# EAGLE design obd25k80 (EAGLE 9.6.2)
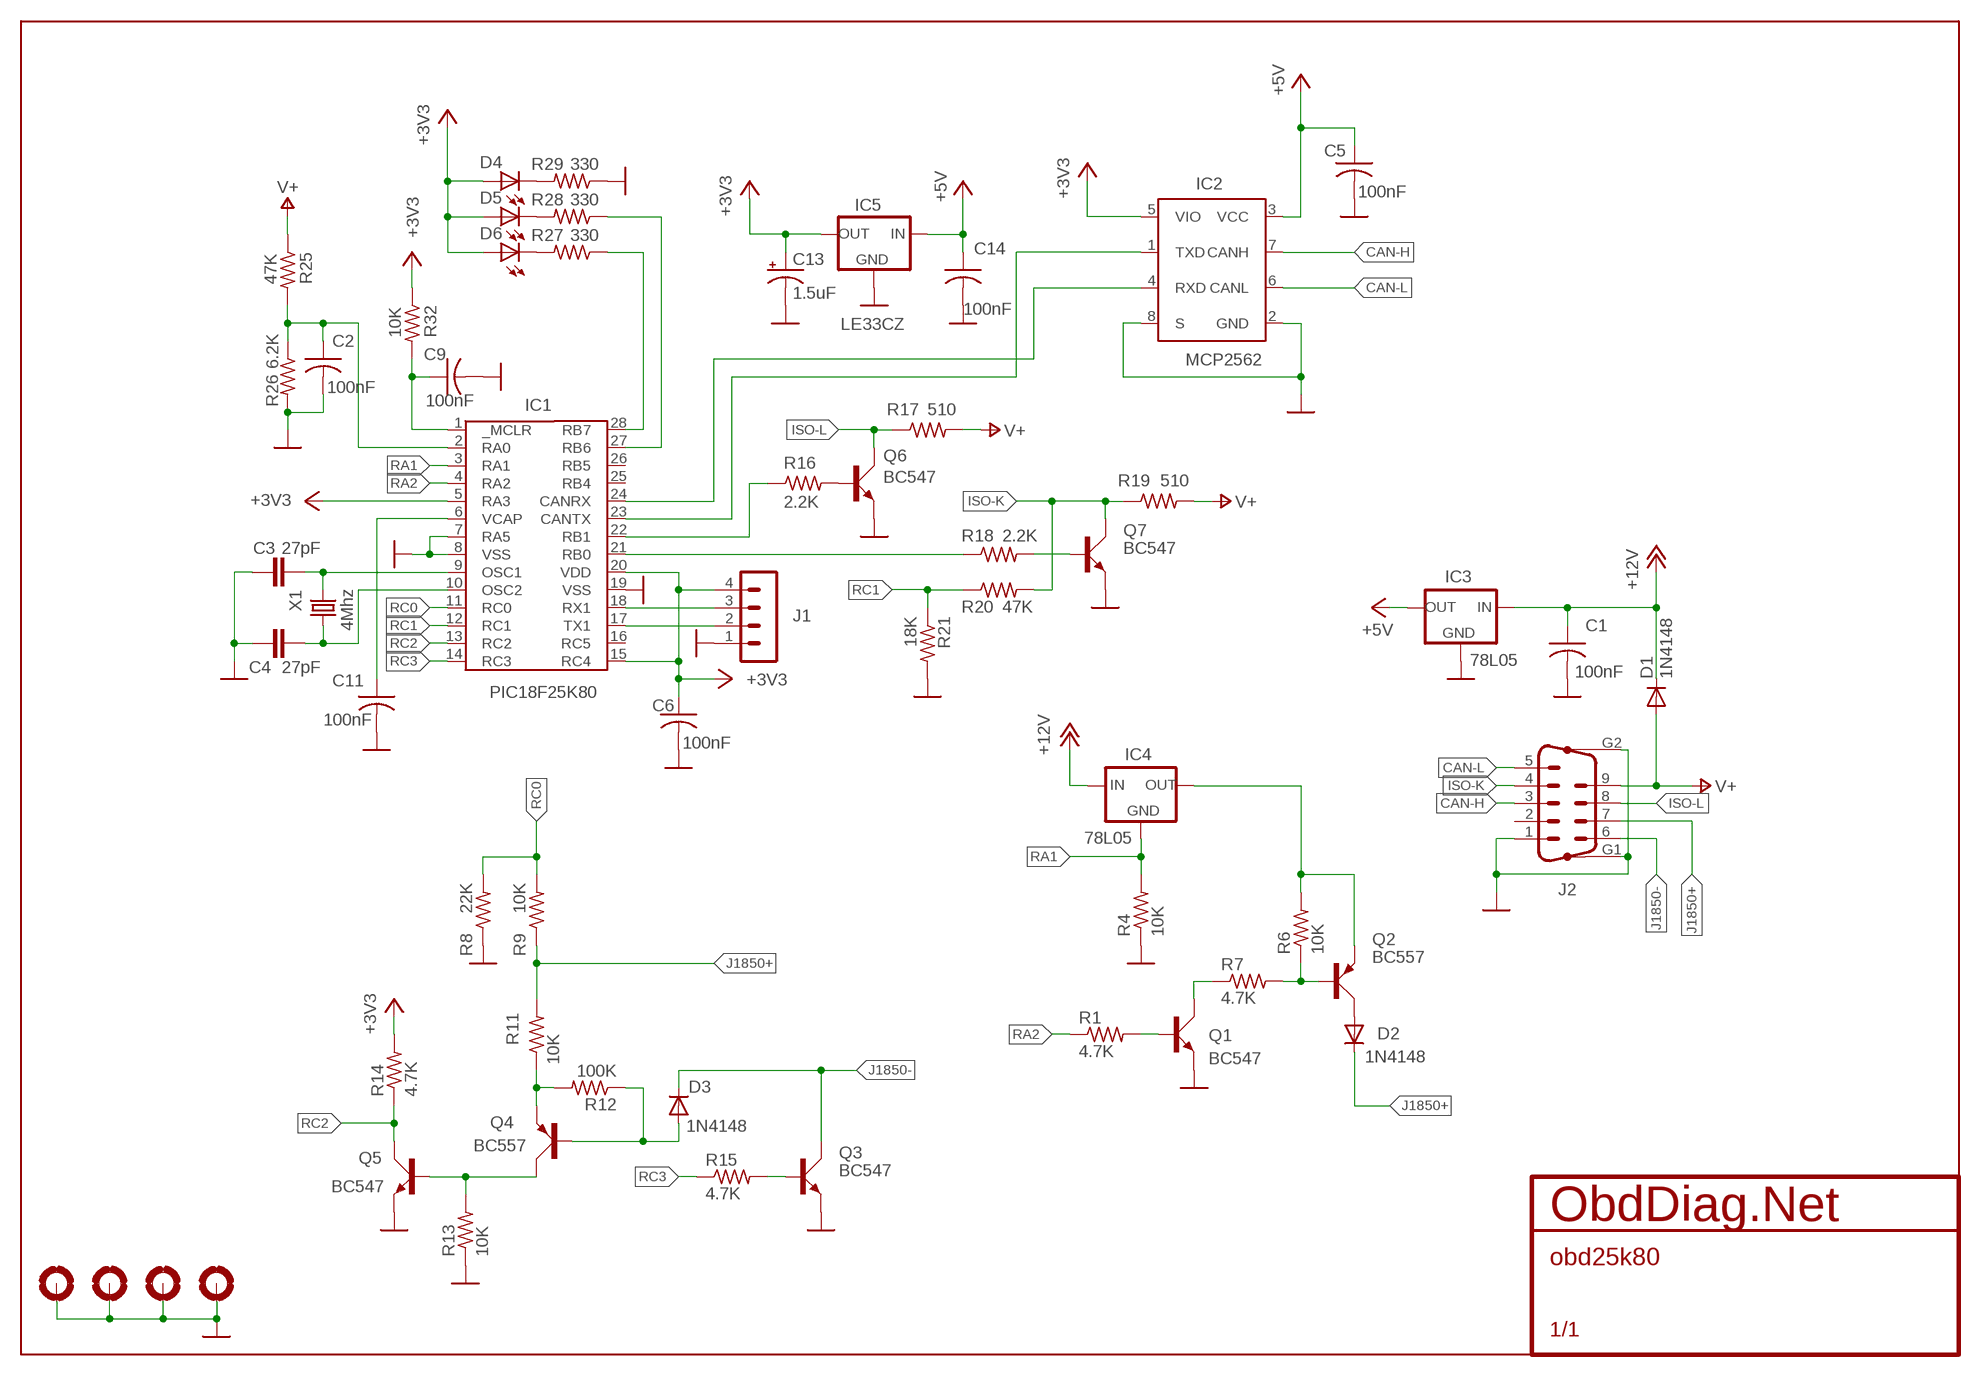
[diagram p0: schematic, sheet 1]

## Parts
C1  100nF  C-US050-025X075  [C050-025X075]
C2  100nF  C-US050-025X075  [C050-025X075]
C3  27pF  C2.5/2  [C2.5-2]
C4  27pF  C2.5/2  [C2.5-2]
C5  100nF  C-US050-025X075  [C050-025X075]
C6  100nF  C-US050-025X075  [C050-025X075]
C9  100nF  C-US050-025X075  [C050-025X075]
C11  100nF  C-US050-025X075  [C050-025X075]
C13  1.5uF  CPOL-USE2.5-5  [E2,5-5]
C14  100nF  C-US050-025X075  [C050-025X075]
D1  1N4148  1N4148M  [D035-10M]
D2  1N4148  1N4148M  [D035-10M]
D3  1N4148  1N4148M  [D035-10M]
D4  LED5MM  [LED5MM]
D5  LED5MM  [LED5MM]
D6  LED5MM  [LED5MM]
H1  MOUNT-PAD-ROUND2.8  [2,8-PAD]
H2  MOUNT-PAD-ROUND2.8  [2,8-PAD]
H3  MOUNT-PAD-ROUND2.8  [2,8-PAD]
H4  MOUNT-PAD-ROUND2.8  [2,8-PAD]
IC1  PIC18F25K80  [DIL28]
IC2  MCP2562  [DIL8]
IC3  78L05  78LXX  [78LXX]
IC4  78L05  78LXX  [78LXX]
IC5  LE33CZ  78LXX  [78LXX]
J1  MA04-1  [MA04-1]
J2  DB9-M  M09HP  [M09HP]
Q1  BC547  [SOT54A]
Q2  BC557  [SOT54A]
Q3  BC547  [SOT54A]
Q4  BC557  [SOT54A]
Q5  BC547  [SOT54A]
Q6  BC547  [SOT54A]
Q7  BC547  [SOT54A]
R1  4.7K  R-US_0207/10  [0207/10]
R4  10K  R-US_0207/10  [0207/10]
R6  10K  R-US_0207/10  [0207/10]
R7  4.7K  R-US_0207/10  [0207/10]
R8  22K  R-US_0207/10  [0207/10]
R9  10K  R-US_0207/10  [0207/10]
R11  10K  R-US_0207/10  [0207/10]
R12  100K  R-US_0207/10  [0207/10]
R13  10K  R-US_0207/10  [0207/10]
R14  4.7K  R-US_0207/10  [0207/10]
R15  4.7K  R-US_0207/10  [0207/10]
R16  2.2K  R-US_0207/10  [0207/10]
R17  510  R-US_0207/10  [0207/10]
R18  2.2K  R-US_0207/10  [0207/10]
R19  510  R-US_0207/10  [0207/10]
R20  47K  R-US_0207/10  [0207/10]
R21  18K  R-US_0207/10  [0207/10]
R25  47K  R-US_0207/10  [0207/10]
R26  6.2K  R-US_0207/10  [0207/10]
R27  330  R-US_0207/10  [0207/10]
R28  330  R-US_0207/10  [0207/10]
R29  330  R-US_0207/10  [0207/10]
R32  10K  R-US_0207/10  [0207/10]
X1  4Mhz  CRYTALHC49S  [HC49/S]

## Nets
+3V3: C6.1 C13.+ D4.A D5.A D6.A IC1.5(RA3) IC1.15(RC4) IC1.20(VDD) IC2.5(VIO) IC5.OUT J1.4 R14.2 R32.1
+5V: C5.1 C14.1 IC2.3(VCC) IC3.OUT IC5.IN
+12V: C1.1 D1.C IC3.IN IC4.IN
CAN-H: IC2.7(CANH) J2.3
CAN-L: IC2.6(CANL) J2.5
GND: C1.2 C2.2 C3.1 C4.2 C5.2 C6.2 C9.2 C11.2 C13.- C14.2 H1.B2,8(MOUNT) H2.B2,8(MOUNT) H3.B2,8(MOUNT) H4.B2,8(MOUNT) IC1.7(RA5) IC1.8(VSS) IC1.19(VSS) IC2.2(GND) IC2.8(S) IC3.GND IC5.GND J1.1 J2.1 J2.G1 J2.G2 Q1.E Q3.E Q5.E Q6.E Q7.E R4.1 R8.1 R13.1 R21.2 R26.2 R29.1
ISO-K: J2.4 Q7.C R19.1 R20.2
ISO-L: J2.8 Q6.C R17.1
J1850+: D2.C J2.7 R9.1 R11.2
J1850-: D3.C J2.6 Q3.C
N$1: D4.K(C) R29.2
N$2: IC1.28(RB7) R27.1
N$6: D5.K(C) R28.2
N$7: C9.1 IC1.1(_MCLR) R32.2
N$9: IC1.22(RB1) R16.1
N$10: D6.K(C) R27.2
N$11: IC1.27(RB6) R28.1
N$14: C11.1 IC1.6(VCAP)
N$15: Q6.B R16.2
N$16: IC1.18(RX1) J1.3
N$17: IC1.24(CANRX) IC2.4(RXD)
N$18: IC1.17(TX1) J1.2
N$20: IC1.21(RB0) R18.1
N$21: C3.2 IC1.9(OSC1) X1.2
N$22: Q3.B R15.2
N$23: IC1.23(CANTX) IC2.1(TXD)
N$24: Q7.B R18.2
N$25: Q1.C R7.1
N$26: C2.1 IC1.2(RA0) R25.2 R26.1
N$28: Q1.B R1.2
N$30: Q2.B R6.1 R7.2
N$31: IC4.OUT Q2.E R6.2
N$32: D2.A Q2.C
N$37: Q4.E R11.1 R12.2
N$38: D3.A Q4.B R12.1
N$39: Q4.C Q5.B R13.2
N$41: C4.1 IC1.10(OSC2) X1.1
RA1: IC1.3(RA1) IC4.GND R4.2
RA2: IC1.4(RA2) R1.1
RC0: IC1.11(RC0) R8.2 R9.2
RC1: IC1.12(RC1) R20.1 R21.1
RC2: IC1.13(RC2) Q5.C R14.1
RC3: IC1.14(RC3) R15.1
V+: D1.A J2.9 R17.2 R19.2 R25.1
Unconnected: IC1.16(RC5) IC1.25(RB4) IC1.26(RB5) J2.2

## Library data of the parts
C1 C2 C5 C6 C9 C11 C14 = rcl:C-US: CAPACITOR, American symbol; SPICEPREFIX: C
C3 C4 = capacitor-wima:C: CAPACITOR naming: grid - package width
C13 = rcl:CPOL-US: POLARIZED CAPACITOR, American symbol
D1-D3 = diode:1N4148: DIODE high speed (Philips)
D4-D6 = led:LED: LED OSRAM: - CHIPLED LG R971, LG N971, LY N971, LG Q971, LY Q971, LO R971, LY R971 LH N974, LH R974 LS Q976, LO Q976, LY Q976 LO Q996 - Hyper CHIPLED LW Q18S LB Q993, LB Q99A, LB R99A - SideLED LS A670, LO A670, LY A670, LG A670, LP A670 LB A673, LV A673, LT A673, LW A673 LH A674 LY A675 LS A676, LA A676, LO A676, LY A676, LW A676 LS A679, LY A679, LG A679 - Hyper Micro SIDELED® LS Y876, LA Y876, LO Y876, LY Y876 LT Y87S - SmartLED LW L88C, LW L88S LB L89C, LB L89S, LG L890 LS L89K, LO L89K, LY L89K LS L896, LA L896, LO L896, LY L896 - TOPLED LS T670, LO T670, LY T670, LG T670, LP T670 LSG T670, LSP T670, LSY T670, LOP T670, LYG T670 LG T671, LOG T671, LSG T671 LB T673, LV T673, LT T673, LW T673 LH T674 LS T676, LA T676, LO T676, LY T676, LB T676, LH T676, LSB T676, LW T676 LB T67C, LV T67C, LT T67C, LS T67K, LO T67K, LY T67K, LW E67C LS E67B, LA E67B, LO E67B, LY E67B, LB E67C, LV E67C, LT E67C LW T67C LS T679, LY T679, LG T679 LS T770, LO T770, LY T770, LG T770, LP T770 LB T773, LV T773, LT T773, LW T773 LH T774 LS E675, LA E675, LY E675, LS T675 LS T776, LA T776, LO T776, LY T776, LB T776 LHGB T686 LT T68C, LB T68C - Hyper Mini TOPLED® LB M676 - Mini TOPLED Santana® LG M470 LS M47K, LO M47K, LY M47K Source: http://www.osram.convergy.de LUXEON: - LUMILED® LXK2-PW12-R00, LXK2-PW12-S00, LXK2-PW14-U00, LXK2-PW14-V00 LXK2-PM12-R00, LXK2-PM12-S00, LXK2-PM14-U00 LXK2-PE12-Q00, LXK2-PE12-R00, LXK2-PE12-S00, LXK2-PE14-T00, LXK2-PE14-U00 LXK2-PB12-K00, LXK2-PB12-L00, LXK2-PB12-M00, LXK2-PB14-N00, LXK2-PB14-P00, LXK2-PB14-Q00 LXK2-PR12-L00, LXK2-PR12-M00, LXK2-PR14-Q00, LXK2-PR14-R00 LXK2-PD12-Q00, LXK2-PD12-R00, LXK2-PD12-S00 LXK2-PH12-R00, LXK2-PH12-S00 LXK2-PL12-P00, LXK2-PL12-Q00, LXK2-PL12-R00 Source: www.luxeon.com KINGBRIGHT: KA-3528ASYC Source: www.kingbright.com
H1-H4 = holes:MOUNT-PAD-ROUND: MOUNTING PAD, round
IC1 = pic18f2455:PIC18F25K80
IC2 = obddiag-net:MCP2562
IC3-IC5 = v-reg:78LXX: VOLTAGE REGULATOR
J1 = obddiag-net:MA04-1
J2 = con-subd:M09HP: SUB-D
Q1 Q3 Q5-Q7 = transistor-small-signal:BC547: NPN TRANSISTOR
Q2 Q4 = transistor-small-signal:BC557: PNP TRANSISTOR
R1 R4 R6-R9 R11-R21 R25-R29 R32 = rcl:R-US_: RESISTOR, American symbol
X1 = crystal:CRYTAL: CRYSTAL

## Board
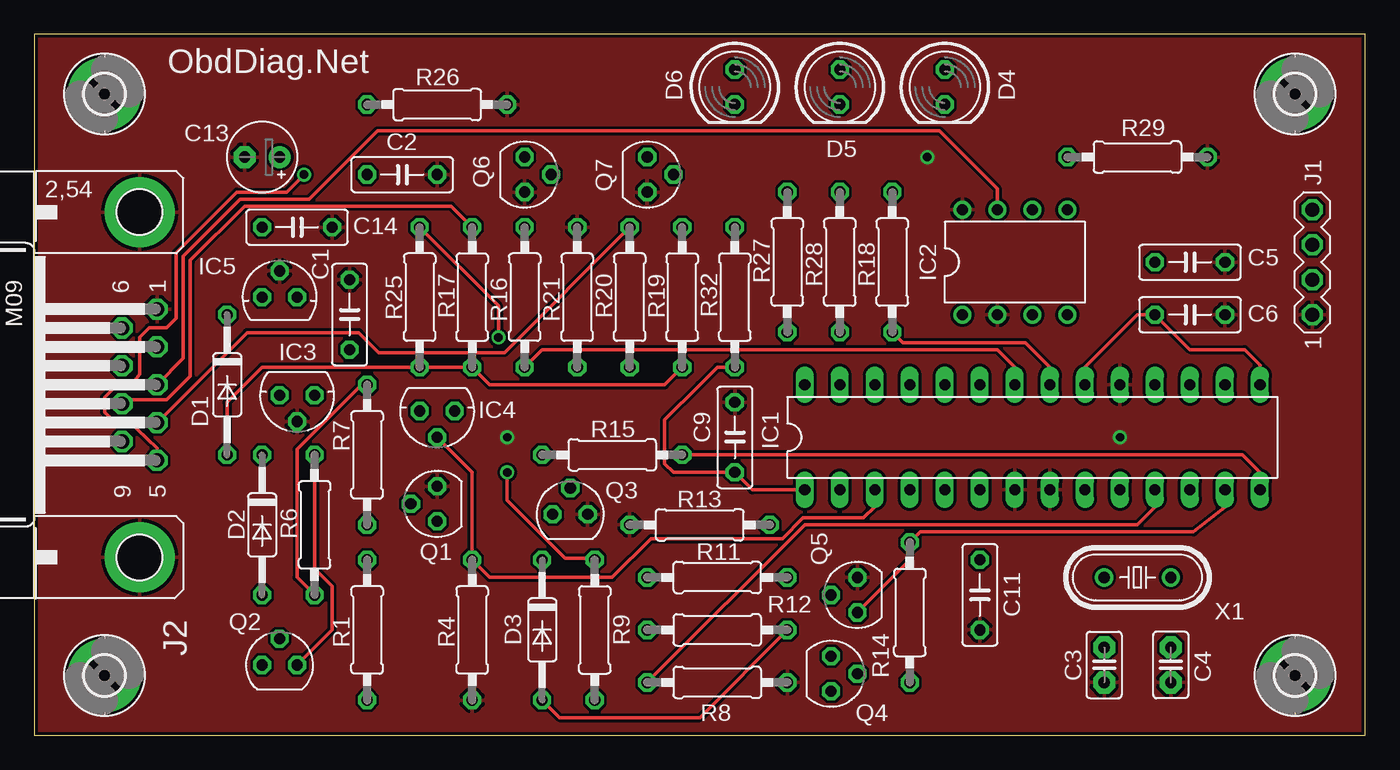
[diagram p1: board, top side]
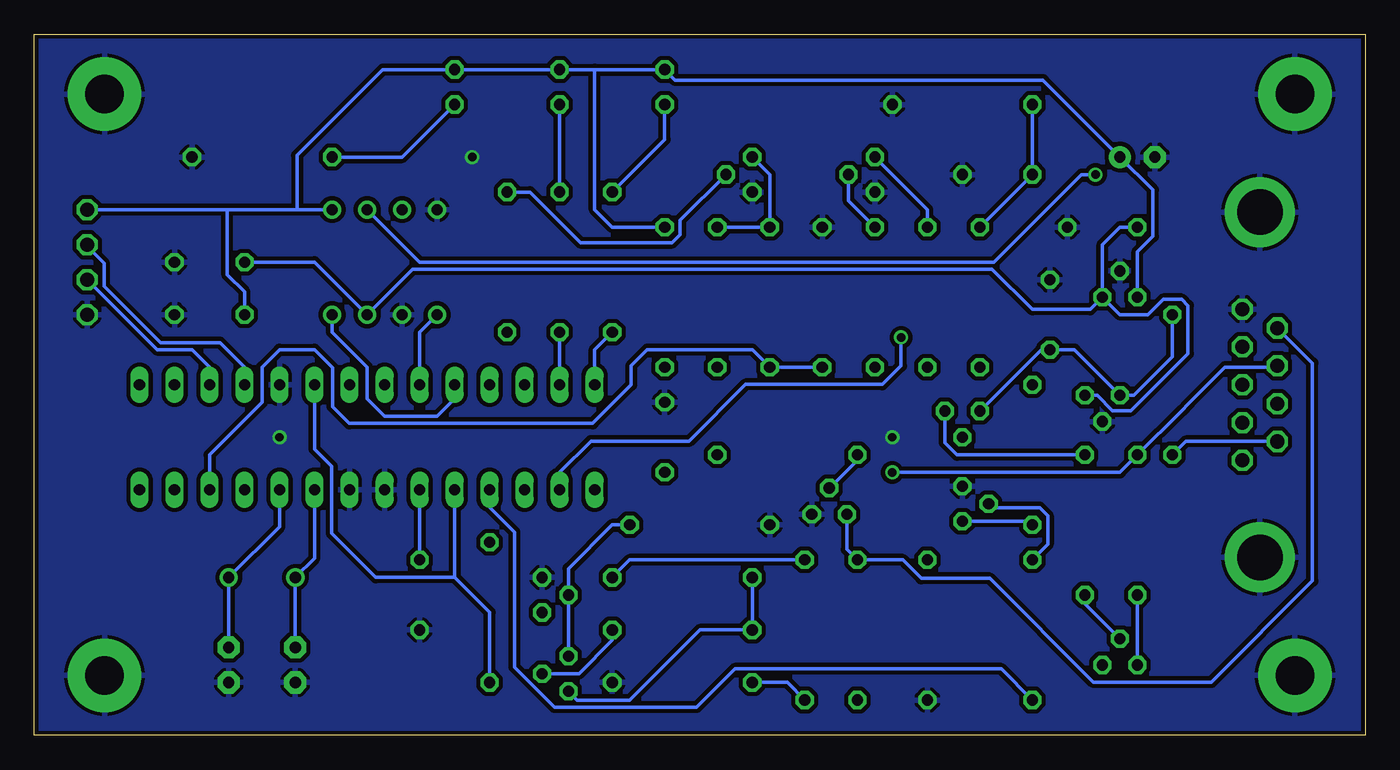
[diagram p2: board, bottom side, seen from below]

Size 96.52 x 50.8 mm. Coordinates in mm from the lower left corner, seen from the top.
Outline: 0,0 96.52,0 96.52,50.8 0,50.8 0,0
Copper layers (1*16): Top 0.035mm / dielectric 1.5mm / Bottom 0.035mm
Design rules "default *": minimum track width 10mil, minimum drill 24mil, track to track 8mil, track to pad 8mil, pad to pad 5mil, via to via 8mil, smd to smd 5mil, copper to edge 10mil, drill to drill 8mil, minimum pad ring 10mil, minimum via ring 8mil, stop-mask expansion 4mil, vias tented up to drill 0mil, thermal gap 10mil

### Footprints (pad centres in the part's own frame; a part is rotated, then mirrored left to right if it is on the bottom)
C050-025X075 = drill 0.813 octagon: 1 -2.54,0; 2 2.54,0
C2.5-2 = drill 0.813 pad 1.6 octagon: 1 -1.27,0; 2 1.27,0
E2,5-5 = drill 0.813 pad 1.6: + -1.27,0 | drill 0.813 pad 1.6 octagon: - 1.27,0
D035-10M = drill 0.813 octagon: A 5.08,0; C -5.08,0
LED5MM = drill 0.813 octagon: A -1.27,0; K 1.27,0
2,8-PAD = drill 2.8 pad 5.334: B2,8 0,0
DIL28 = drill 0.813 long: 1 -16.51,-3.81; 2 -13.97,-3.81; 3 -11.43,-3.81; 4 -8.89,-3.81; 5 -6.35,-3.81; 6 -3.81,-3.81; 7 -1.27,-3.81; 8 1.27,-3.81; 9 3.81,-3.81; 10 6.35,-3.81; 11 8.89,-3.81; 12 11.43,-3.81; 13 13.97,-3.81; 14 16.51,-3.81; 15 16.51,3.81; 16 13.97,3.81; 17 11.43,3.81; 18 8.89,3.81; 19 6.35,3.81; 20 3.81,3.81; 21 1.27,3.81; 22 -1.27,3.81; 23 -3.81,3.81; 24 -6.35,3.81; 25 -8.89,3.81; 26 -11.43,3.81; 27 -13.97,3.81; 28 -16.51,3.81
DIL8 = drill 0.813 pad 1.27: 1 -3.81,-3.81; 2 -1.27,-3.81; 3 1.27,-3.81; 4 3.81,-3.81; 5 3.81,3.81; 6 1.27,3.81; 7 -1.27,3.81; 8 -3.81,3.81
78LXX = drill 0.813 octagon: GND 0,1.905; IN 1.27,0; OUT -1.27,0
MA04-1 = drill 1.016 octagon: 1 -3.81,0; 2 -1.27,0; 3 1.27,0; 4 3.81,0
M09HP = drill 1.016 octagon: 1 -5.486,1.27; 2 -2.743,1.27; 3 0,1.27; 4 2.743,1.27; 5 5.486,1.27; 6 -4.115,-1.27; 7 -1.372,-1.27; 8 1.372,-1.27; 9 4.115,-1.27 | drill 3.302 pad 5.08: G1 -12.522,0; G2 12.522,0
SOT54A = drill 0.813 octagon: B 0,1.905; C -1.27,0; E 1.27,0
0207/10 = drill 0.813 octagon: 1 -5.08,0; 2 5.08,0
HC49/S = drill 0.813: 1 -2.413,0; 2 2.413,0

### Placement (x,y rotation side)
C1  22.86,30.48 90 top
C2  26.67,40.64 0 top
C3  77.6,5.08 90 top
C4  82.42,5.08 270 top
C5  83.82,34.29 0 top
C6  83.82,30.48 0 top
C9  50.8,21.59 90 top
C11  68.58,10.16 270 top
C13  2.2uF  [E2,5-5]  16.51,41.91 180 top
C14  19.05,36.83 0 top
D1  13.97,25.4 270 top
D2  16.51,15.24 270 top
D3  36.83,7.62 270 top
D4  66.04,46.99 270 top
D5  58.42,46.99 270 top
D6  50.8,46.99 270 top
H1  5.08,4.32 0 top
H2  5.08,46.48 0 top
H3  91.44,4.32 0 top
H4  91.44,46.48 0 top
IC1  72.39,21.59 0 top
IC2  71.12,34.29 0 top
IC3  19.05,24.64 180 top
IC4  29.21,23.5 180 top
IC5  17.78,31.75 0 top
J1  92.71,34.29 90 top
J2  7.62,25.4 270 top
Q1  29.21,16.76 90 top
Q2  17.78,5.08 0 top
Q3  38.86,16 0 top
Q4  57.78,4.45 270 top
Q5  59.69,10.16 90 top
Q6  35.56,40.64 270 top
Q7  44.45,40.64 270 top
R1  24.13,7.62 90 top
R4  31.75,7.62 90 top
R6  20.32,15.24 90 top
R7  24.13,20.32 90 top
R8  49.53,3.81 180 top
R9  40.64,7.62 270 top
R11  49.53,11.43 0 top
R12  49.53,7.62 180 top
R13  48.26,15.24 0 top
R14  63.5,8.89 270 top
R15  41.91,20.32 180 top
R16  35.56,31.75 90 top
R17  31.75,31.75 270 top
R18  62.23,34.29 90 top
R19  46.99,31.75 270 top
R20  43.18,31.75 90 top
R21  39.37,31.75 90 top
R25  27.94,31.75 90 top
R26  29.21,45.72 0 top
R27  54.61,34.29 90 top
R28  58.42,34.29 90 top
R29  80.01,41.91 180 top
R32  50.8,31.75 270 top
X1  80.01,11.43 180 top

### Tracks (layer width: path | path; a pad name or v marks a point on that pad's centre or on a via)
+3V3
  Top 0.254: IC1.15 88.9,26.8 88.93,26.8 87.79,27.94 83.82,27.94 C6.1 80.01,30.48 76.2,26.67 IC1.20
  Bottom 0.254: 55.88,48.26 D5.A D4.A 71.25,48.26 77.47,42.04 77.47,38.1 | 55.88,48.26 D6.A 50.04,47.5 23.37,47.5 C13.+ 15.39,39.52 15.39,36.17 16.51,35.05 IC5.OUT | C6.1 81.28,32.13 82.53,33.37 82.53,38.08 82.55,38.1 | IC1.20 76.2,20.73 74.95,19.49 74.95,14.63 71.76,11.43 66.04,11.43 | R32.1 54.61,36.83 55.88,38.1 55.88,48.26 | IC1.5 66.04,11.43 | 66.04,11.43 63.5,8.89 R14.2 | IC2.5 77.47,38.1 | 77.47,38.1 82.55,38.1 | 82.55,38.1 J1.4
+5V
  Bottom 0.254: C5.1 76.2,34.29 IC2.3 69.09,33.78 27.05,33.78 24.13,30.86 19.94,30.86 IC5.IN | IC5.IN 19.05,35.56 17.78,36.83 C14.1 | IC3.OUT 19.43,24.64 18.32,23.52 16.99,23.52 12.85,27.66 12.85,31.14 13.31,31.6 14.63,31.6 15.75,30.48 17.78,30.48 IC5.IN
+12V
  Bottom 0.254: D1.C 13.97,27.43 16.76,24.64 IC3.IN 21.08,27.94 C1.1 23.5,27.94 IC4.IN
CAN-H
  Top 0.254: IC2.7 69.85,39.62 65.66,43.81 24.89,43.81 19.93,38.86 14.94,38.86 10.79,34.72 10.79,27.3 J2.3
CAN-L  (via drill 0.61)
  Top 0.254: J2.5 8.89,20.8 6.73,22.86 5.64,22.86 5.08,23.42 5.08,24.48 5.97,25.38 7.01,25.38 7.62,26.17 7.62,28.85 8.31,29.54 9.6,29.54 10.29,30.23 10.29,34.99 14.67,39.37 18.29,39.37 v19.56,40.64
  Bottom 0.254: IC2.6 68.58,34.29 26.92,34.29 20.57,40.64 v19.56,40.64
GND  (via drill 0.61)
  other vias: 34.29,21.59 78.74,21.59 64.77,41.91
  pour Bottom (isolate 0.305): 0,50.8 96.52,50.8 96.52,49.53 96.52,0 0,0 0,1.27
  pour Top: 0,0 0,50.8 96.52,50.8 96.52,0
ISO-K
  Top 0.254: R20.2 34.09,27.74 24.97,27.74 23.52,29.18 15.42,29.18 J2.4
  Bottom 0.254: R19.1 R20.2 43.18,40.64 Q7.C
ISO-L
  Top 0.254: J2.8 6.63,24.31 9.6,24.31 11.3,26.01 11.3,34.29 11.3,34.31 11.3,34.42 15.24,38.35 30.23,38.35 R17.1
  Bottom 0.254: R17.1 31.75,38.1 Q6.C
J1850+  (via drill 0.61)
  Top 0.254: R9.1 40.51,12.83 38.48,12.83 34.29,17.02 v34.29,19.05
  Bottom 0.254: R9.1 53.34,12.7 R11.2 | v34.29,19.05 17.78,19.05 D2.C 13.34,23.5 12.78,24.05 10.16,26.67 6.45,26.67 J2.7
J1850-
  Bottom 0.254: J2.6 3.81,26.98 3.81,11.18 11.15,3.83 19.7,3.83 27.22,11.35 32.18,11.35 33.27,12.45 33.53,12.7 D3.C 37.59,13.46 Q3.C
N$1
  Bottom 0.254: R29.2 69.85,41.91 D4.K
N$2
  Bottom 0.254: IC1.28 55.88,27.94 R27.1
N$6
  Bottom 0.254: R28.2 D5.K
N$7
  Top 0.254: IC1.1 52.07,17.78 C9.1 46.35,19.05 45.72,19.68 45.72,22.86 48.23,25.38 49.53,26.67 R32.2
N$9
  Top 0.254: IC1.22 71.12,26.67 69.85,27.94 36.83,27.94 R16.1
N$10
  Bottom 0.254: R27.2 50.8,43.18 D6.K
N$11
  Bottom 0.254: IC1.27 R28.1
N$14
  Bottom 0.254: IC1.6 C11.1
N$15
  Bottom 0.254: R16.2 37.47,38.73 Q6.B
N$16
  Bottom 0.254: J1.3 92.71,35.43 91.48,34.2 91.48,32.55 87.38,28.45 83.06,28.45 81.28,26.67 IC1.18
N$17
  Bottom 0.254: IC2.4 74.93,29.21 72.39,26.67 72.39,24.38 71.12,23.11 67.31,23.11 66.04,24.38 IC1.24
N$18
  Bottom 0.254: J1.2 87.63,27.94 85.09,27.94 83.82,26.67 IC1.17
N$20
  Top 0.254: IC1.21 73.66,26.67 71.88,28.45 62.99,28.45 R18.1
N$21  (via drill 0.61)
  Top 0.254: v77.6,6.48 C3.2
  Bottom 0.254: IC1.9 76.2,12.83 X1.2 v77.6,6.48
N$22
  Bottom 0.254: Q3.B 36.83,19.94 R15.2
N$23
  Bottom 0.254: IC1.23 68.58,29.21 IC2.1
N$24
  Bottom 0.254: R18.2 60.58,39.37 56.92,35.71 50.26,35.71 49.68,36.29 49.68,37.31 Q7.B
N$25
  Bottom 0.254: R7.1 24.38,15.49 Q1.C
N$26  (via drill 0.61)
  Top 0.254: R25.2 33.66,31.11 v33.66,28.83
  Bottom 0.254: R26.1 C2.1 R25.2 | v33.66,28.83 33.66,26.77 34.03,26.41 35.02,25.43 44.94,25.43 49.05,21.31 56.16,21.31 58.42,19.05 IC1.2
N$28
  Bottom 0.254: Q1.B 27.03,16.48 23.59,16.48 23.01,15.9 23.01,13.82 R1.2
N$30
  Top 0.254: R6.1 19.05,11.43 19.05,20.7 23.75,25.4 R7.2
  Bottom 0.254: Q2.B 20.32,9.53 R6.1
N$31
  Top 0.254: Q2.E 21.59,7.62 21.59,10.79 20.32,12.06 R6.2
  Bottom 0.254: IC4.OUT 30.48,21.2 29.59,20.32 R6.2
N$32
  Bottom 0.254: Q2.C D2.A
N$37
  Bottom 0.254: R11.1 R12.2 48.26,7.62 53.34,2.54 57.15,2.54 Q4.E
N$38
  Top 0.254: R12.1 48.26,1.27 38.1,1.27 D3.A
  Bottom 0.254: Q4.B 57.02,4.45 54.61,6.86 R12.1
N$39
  Bottom 0.254: Q4.C Q5.B 57.78,12.06 54.61,15.24 R13.2
N$41  (via drill 0.61)
  Top 0.254: v82.42,6.48 C4.1
  Bottom 0.254: v82.42,6.48 X1.1 78.74,15.11 IC1.10
RA1
  Top 0.254: IC1.3 60.96,16.56 60.15,15.75 55.74,15.75 54.24,14.25 44.73,14.25 41.91,11.43 33.02,11.43 R4.2 31.75,19.05 IC4.GND
RA2
  Bottom 0.254: R1.1 26.39,4.8 45.72,4.8 48.49,2.03 58.8,2.03 61.7,4.92 61.7,14.71 63.5,16.51 IC1.4
RC0
  Top 0.254: IC1.11 81.28,16.51 80.01,15.24 55.88,15.24 R8.2
  Bottom 0.254: R9.2 41.91,3.81 R8.2
RC1
  Bottom 0.254: R21.1 R20.1 44.45,27.94 52.07,27.94 53.24,26.77 53.24,25.4 56.03,22.61 73.69,22.61 74.91,23.82 74.91,26.64 76.2,27.94 78.74,27.94 80.01,26.67 80.01,24.13 83.82,20.32 IC1.12
RC2
  Top 0.254: IC1.13 86.36,16.51 84.07,14.73 64.26,14.73 R14.1 63.5,12.7 Q5.C
RC3
  Top 0.254: IC1.14 88.9,19.05 87.63,20.32 R15.1
V+
  Top 0.254: D1.A 13.97,24.13 16.51,26.67 R25.1 R17.2 33.02,25.4 45.72,25.4 R19.2
  Bottom 0.254: J2.9 13.01,21.29 D1.A

### Text on the board
tNames: ObdDiag.Net